# Altium schematic sheet P07 Hi3519 Power.SchDoc
size 420 x 297 mm
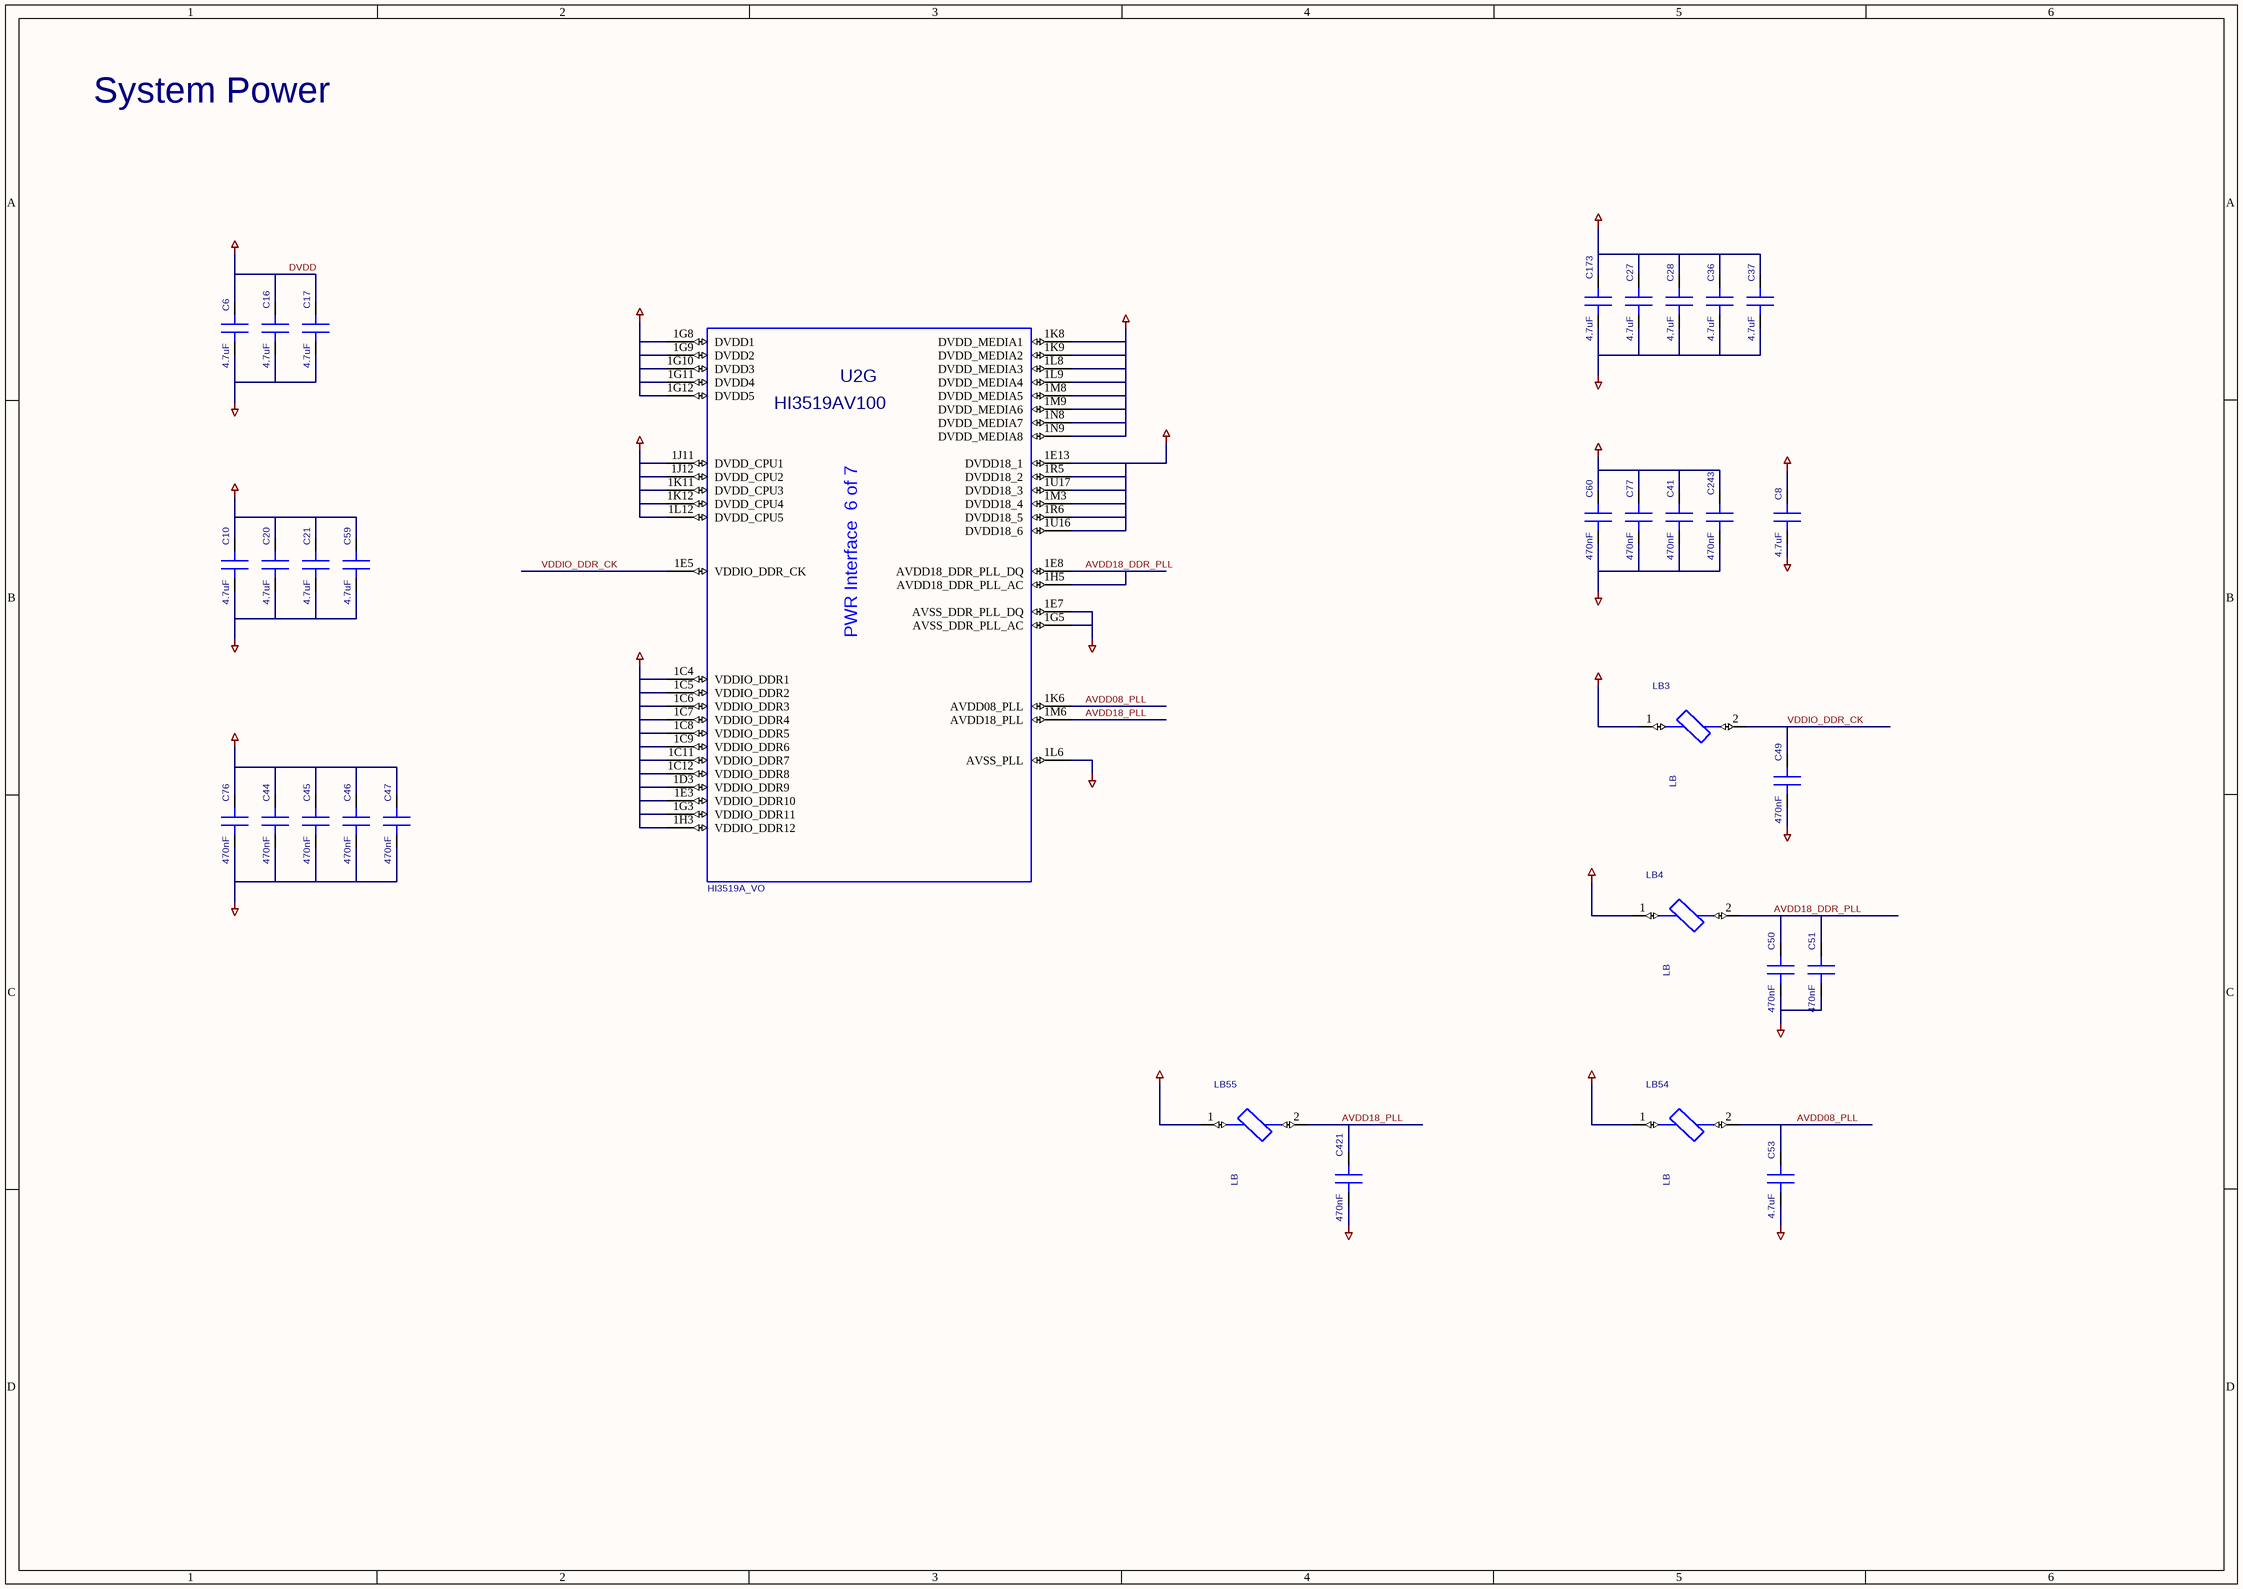
[diagram p0: P07 Hi3519 Power.SchDoc]

## Parts
C6  4.7uF  [SC0402-BGA]
C8  4.7uF  [SC0402-BGA]
C10  4.7uF  [SC0402-BGA]
C16  4.7uF  [SC0402-BGA]
C17  4.7uF  [SC0402-BGA]
C20  4.7uF  [SC0402-BGA]
C21  4.7uF  [SC0402-BGA]
C27  4.7uF  [SC0402-BGA]
C28  4.7uF  [SC0402-BGA]
C36  4.7uF  [SC0402-BGA]
C37  4.7uF  [SC0402-BGA]
C41  470nF  [SC0402-BGA]
C44  470nF  [SC0402-BGA]
C45  470nF  [SC0402-BGA]
C46  470nF  [SC0402-BGA]
C47  470nF  [SC0402-BGA]
C49  470nF  [SC0402-BGA]
C50  470nF  [SC0402-BGA]
C51  470nF  [SC0402-BGA]
C53  4.7uF  [SC0402-BGA]
C59  4.7uF  [SC0402-BGA]
C60  470nF  [SC0402-BGA]
C76  470nF  [SC0402-BGA]
C77  470nF  [SC0402-BGA]
C173  4.7uF  [SC0402-BGA]
C243  470nF  [SC0402-BGA]
C421  470nF  [SC0402-BGA]
LB3  LB  [SL0402]
LB4  LB  [SL0402]
LB54  LB  [SL0402]
LB55  LB  [SL0402]
U2  HI3519A_VO  DEVICE: HI3519AV100  [HBGA567-16-3737]  (part G of 7)

## Nets
0V8_LDO: LB54.1
1V2: C44.1(A) C45.1(A) C46.1(A) C47.1(A) C76.1(A) LB3.1 U2.1C4(VDDIO_DDR1) U2.1C5(VDDIO_DDR2) U2.1C6(VDDIO_DDR3) U2.1C7(VDDIO_DDR4) U2.1C8(VDDIO_DDR5) U2.1C9(VDDIO_DDR6) U2.1C11(VDDIO_DDR7) U2.1C12(VDDIO_DDR8) U2.1D3(VDDIO_DDR9) U2.1E3(VDDIO_DDR10) U2.1G3(VDDIO_DDR11) U2.1H3(VDDIO_DDR12)
1V8: C41.1(A) C60.1(A) C77.1(A) C243.1(A) LB4.1 LB55.1 U2.1E13(DVDD18_1) U2.1M3(DVDD18_4) U2.1R5(DVDD18_2) U2.1R6(DVDD18_5) U2.1U16(DVDD18_6) U2.1U17(DVDD18_3)
3V3: C8.1(A)
DVDD: C6.1(A) C16.1(A) C17.1(A) U2.1G8(DVDD1) U2.1G9(DVDD2) U2.1G10(DVDD3) U2.1G11(DVDD4) U2.1G12(DVDD5)
DVDD_CPU_MEDIA: C10.1(A) C20.1(A) C21.1(A) C27.1(A) C28.1(A) C36.1(A) C37.1(A) C59.1(A) C173.1(A) U2.1J11(DVDD_CPU1) U2.1J12(DVDD_CPU2) U2.1K8(DVDD_MEDIA1) U2.1K9(DVDD_MEDIA2) U2.1K11(DVDD_CPU3) U2.1K12(DVDD_CPU4) U2.1L8(DVDD_MEDIA3) U2.1L9(DVDD_MEDIA4) U2.1L12(DVDD_CPU5) U2.1M8(DVDD_MEDIA5) U2.1M9(DVDD_MEDIA6) U2.1N8(DVDD_MEDIA7) U2.1N9(DVDD_MEDIA8)
GND: C6.2(B) C8.2(B) C10.2(B) C16.2(B) C17.2(B) C20.2(B) C21.2(B) C27.2(B) C28.2(B) C36.2(B) C37.2(B) C41.2(B) C44.2(B) C45.2(B) C46.2(B) C47.2(B) C49.2(B) C50.2(B) C51.2(B) C53.2(B) C59.2(B) C60.2(B) C76.2(B) C77.2(B) C173.2(B) C243.2(B) C421.2(B) U2.1E7(AVSS_DDR_PLL_DQ) U2.1G5(AVSS_DDR_PLL_AC) U2.1L6(AVSS_PLL)
AVDD08_PLL: C53.1(A) LB54.2 U2.1K6(AVDD08_PLL)
AVDD18_DDR_PLL: C50.1(A) C51.1(A) LB4.2 U2.1E8(AVDD18_DDR_PLL_DQ) U2.1H5(AVDD18_DDR_PLL_AC)
AVDD18_PLL: C421.1(A) LB55.2 U2.1M6(AVDD18_PLL)
VDDIO_DDR_CK: C49.1(A) LB3.2 U2.1E5(VDDIO_DDR_CK)

## Notes on the sheet
- System Power
- (in symbol HI3519A_VO_5, part G) PWR Interface  6 of 7

## Library data of the parts
C6 C8 C16 C17 C21 C28 C53 = C: PARTS: 1; OriginalSymbolOrigin: (0,0); DEVICE: CM05X6T475M06AH-HW; LEVEL: STD; PINSWAP: (A,B); CODE: 8072081; %195%%232%%202%%246%: SMD陶瓷电容-6.3V-4700nF-+/-20%-X6T-0402-华技终端专用; %182%%238%%182%%168%%185%%164%%215%%247%%181%%231%%209%%185%(V): 6.3; COMPONENT_HIGH_MAX: -999999mm; %208%%161%%192%%224%%195%%251%%179%%198%: SMD陶瓷电容; PKG_TYPE: SC0402-BGA
C10 C20 C27 C36 C37 C59 C173 = C: PARTS: 1; OriginalSymbolOrigin: (0,0); DEVICE: CM05X6T475M06AH-HW; LEVEL: STD; PINSWAP: (A,B); %208%%161%%192%%224%%195%%251%%179%%198%: SMD陶瓷电容; COMPONENT_HIGH_MAX: -999999mm; %182%%238%%182%%168%%185%%164%%215%%247%%181%%231%%209%%185%(V): 6.3; %195%%232%%202%%246%: SMD陶瓷电容-6.3V-4700nF-+/-20%-X6T-0402-华技终端专用; CODE: 8072081; PKG_TYPE: SC0402-BGA
C41 C44-C46 C49 C51 C76 C77 = C: PARTS: 1; OriginalSymbolOrigin: (0,0); DEVICE: GRM155R71A474KE01D; LEVEL: STD; PINSWAP: (A,B); CODE: 8072110; %195%%232%%202%%246%: SMD陶瓷电容-6.3V-470nF-+/-10%-X7R-0402; %182%%238%%182%%168%%185%%164%%215%%247%%181%%231%%209%%185%(V): 6.3; COMPONENT_HIGH_MAX: -999999MM; %208%%161%%192%%224%%195%%251%%179%%198%: SMD陶瓷电容; PKG_TYPE: SC0402-BGA
C47 C50 C60 C243 C421 = C: PARTS: 1; OriginalSymbolOrigin: (0,0); DEVICE: GRM155R71A474KE01D; LEVEL: STD; PINSWAP: (A,B); %208%%161%%192%%224%%195%%251%%179%%198%: SMD陶瓷电容; COMPONENT_HIGH_MAX: -999999MM; %182%%238%%182%%168%%185%%164%%215%%247%%181%%231%%209%%185%(V): 6.3; %195%%232%%202%%246%: SMD陶瓷电容-6.3V-470nF-+/-10%-X7R-0402; CODE: 8072110; PKG_TYPE: SC0402-BGA
LB3 = LB_Dup1: PARTS: 1; OriginalSymbolOrigin: (0,0); LEVEL: STD; DEVICE: BLM15HG102SN1D; CODE: 10070019; %195%%232%%202%%246%: EMI磁珠-+/-25%-1000ohm-1.25ohm-0.25A-0402-1400ohm@1GHZ; COMPONENT_HIGH_MAX: 0.65MM; %208%%161%%192%%224%%195%%251%%179%%198%: EMI磁珠; PKG_TYPE: SL0402
LB4 LB55 = LB_Dup1: PARTS: 1; OriginalSymbolOrigin: (0,0); LEVEL: STD; DEVICE: BLM15HG102SN1D; %195%%232%%202%%246%: EMI磁珠-+/-25%-1000ohm-1.25ohm-0.25A-0402-1400ohm@1GHZ; COMPONENT_HIGH_MAX: 0.65MM; %208%%161%%192%%224%%195%%251%%179%%198%: EMI磁珠; CODE: 10070019; PKG_TYPE: SL0402
LB54 = LB_Dup1: PARTS: 1; OriginalSymbolOrigin: (0,0); LEVEL: STD; DEVICE: BLM15HG102SN1D; CODE: 10070019; %208%%161%%192%%224%%195%%251%%179%%198%: EMI磁珠; COMPONENT_HIGH_MAX: 0.65MM; %195%%232%%202%%246%: EMI磁珠-+/-25%-1000ohm-1.25ohm-0.25A-0402-1400ohm@1GHZ; PKG_TYPE: SL0402
U2 = HI3519A_VO_5: PARTS: 1; OriginalSymbolOrigin: (0,0); LEVEL: STD; HETERO: (HI3519A_DDR),(HI3519A_MIPI),(HI3519A_PER),(HI3519A_SYS),(HI3519A_VO),(HI3519A_PWR),(HI3519A_VSS); CaptureCellPackProp: HI3519A_VOG; PKG_TYPE: HBGA567-16-3737